# Altium schematic sheet fpga20-serdes-power.SchDoc
size Tabloid; SheetNumber: 49; SheetTotal: 71
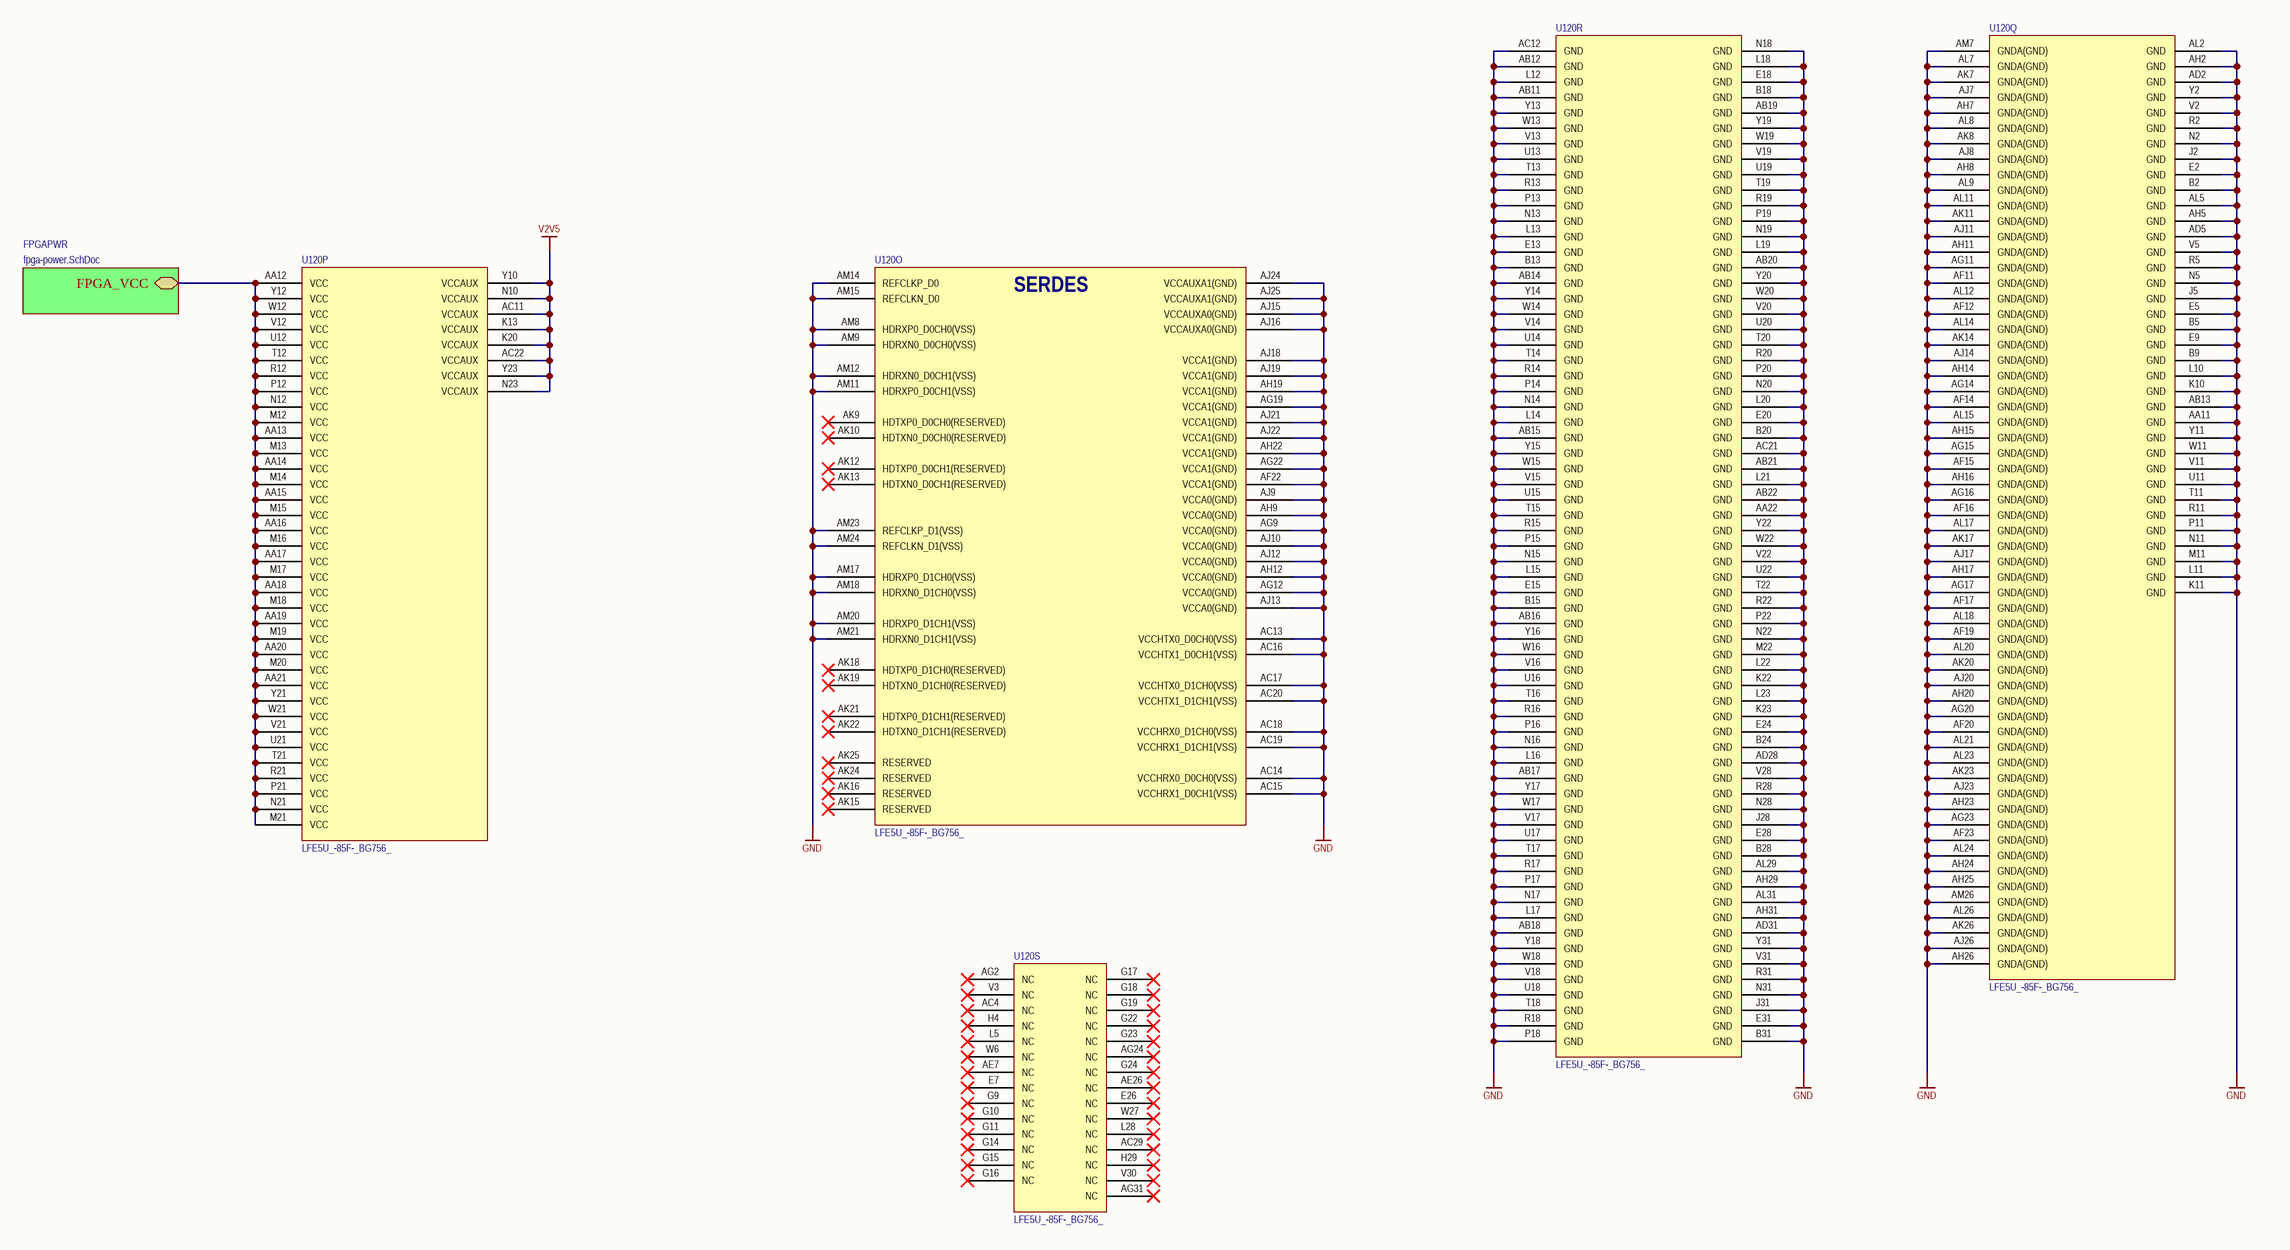
[diagram p0: fpga20-serdes-power.SchDoc]

## Parts
U120  LFE5U_-85F-_BG756_  [caBGA756]  (parts O,P,Q,R,S of 19)

## Sub-sheets
FPGAPWR = fpga-power.SchDoc: FPGA_VCC

## Nets
GND: U120.AA11(GND) U120.AA22(GND) U120.AB11(GND) U120.AB12(GND) U120.AB13(GND) U120.AB14(GND) U120.AB15(GND) U120.AB16(GND) U120.AB17(GND) U120.AB18(GND) U120.AB19(GND) U120.AB20(GND) U120.AB21(GND) U120.AB22(GND) U120.AC12(GND) U120.AC13(VCCHTX0_D0CH0(VSS)) U120.AC14(VCCHRX0_D0CH0(VSS)) U120.AC15(VCCHRX1_D0CH1(VSS)) U120.AC16(VCCHTX1_D0CH1(VSS)) U120.AC17(VCCHTX0_D1CH0(VSS)) U120.AC18(VCCHRX0_D1CH0(VSS)) U120.AC19(VCCHRX1_D1CH1(VSS)) U120.AC20(VCCHTX1_D1CH1(VSS)) U120.AC21(GND) U120.AD2(GND) U120.AD5(GND) U120.AD28(GND) U120.AD31(GND) U120.AF11(GNDA(GND)) U120.AF12(GNDA(GND)) U120.AF14(GNDA(GND)) U120.AF15(GNDA(GND)) U120.AF16(GNDA(GND)) U120.AF17(GNDA(GND)) U120.AF19(GNDA(GND)) U120.AF20(GNDA(GND)) U120.AF22(VCCA1(GND)) U120.AF23(GNDA(GND)) U120.AG9(VCCA0(GND)) U120.AG11(GNDA(GND)) U120.AG12(VCCA0(GND)) U120.AG14(GNDA(GND)) U120.AG15(GNDA(GND)) U120.AG16(GNDA(GND)) U120.AG17(GNDA(GND)) U120.AG19(VCCA1(GND)) U120.AG20(GNDA(GND)) U120.AG22(VCCA1(GND)) U120.AG23(GNDA(GND)) U120.AH2(GND) U120.AH5(GND) U120.AH7(GNDA(GND)) U120.AH8(GNDA(GND)) U120.AH9(VCCA0(GND)) U120.AH11(GNDA(GND)) U120.AH12(VCCA0(GND)) U120.AH14(GNDA(GND)) U120.AH15(GNDA(GND)) U120.AH16(GNDA(GND)) U120.AH17(GNDA(GND)) U120.AH19(VCCA1(GND)) U120.AH20(GNDA(GND)) U120.AH22(VCCA1(GND)) U120.AH23(GNDA(GND)) U120.AH24(GNDA(GND)) U120.AH25(GNDA(GND)) U120.AH26(GNDA(GND)) U120.AH29(GND) U120.AH31(GND) U120.AJ7(GNDA(GND)) U120.AJ8(GNDA(GND)) U120.AJ9(VCCA0(GND)) U120.AJ10(VCCA0(GND)) U120.AJ11(GNDA(GND)) U120.AJ12(VCCA0(GND)) U120.AJ13(VCCA0(GND)) U120.AJ14(GNDA(GND)) U120.AJ15(VCCAUXA0(GND)) U120.AJ16(VCCAUXA0(GND)) U120.AJ17(GNDA(GND)) U120.AJ18(VCCA1(GND)) U120.AJ19(VCCA1(GND)) U120.AJ20(GNDA(GND)) U120.AJ21(VCCA1(GND)) U120.AJ22(VCCA1(GND)) U120.AJ23(GNDA(GND)) U120.AJ24(VCCAUXA1(GND)) U120.AJ25(VCCAUXA1(GND)) U120.AJ26(GNDA(GND)) U120.AK7(GNDA(GND)) U120.AK8(GNDA(GND)) U120.AK11(GNDA(GND)) U120.AK14(GNDA(GND)) U120.AK17(GNDA(GND)) U120.AK20(GNDA(GND)) U120.AK23(GNDA(GND)) U120.AK26(GNDA(GND)) U120.AL2(GND) U120.AL5(GND) U120.AL7(GNDA(GND)) U120.AL8(GNDA(GND)) U120.AL9(GNDA(GND)) U120.AL11(GNDA(GND)) U120.AL12(GNDA(GND)) U120.AL14(GNDA(GND)) U120.AL15(GNDA(GND)) U120.AL17(GNDA(GND)) U120.AL18(GNDA(GND)) U120.AL20(GNDA(GND)) U120.AL21(GNDA(GND)) U120.AL23(GNDA(GND)) U120.AL24(GNDA(GND)) U120.AL26(GNDA(GND)) U120.AL29(GND) U120.AL31(GND) U120.AM7(GNDA(GND)) U120.AM8(HDRXP0_D0CH0(VSS)) U120.AM9(HDRXN0_D0CH0(VSS)) U120.AM11(HDRXP0_D0CH1(VSS)) U120.AM12(HDRXN0_D0CH1(VSS)) U120.AM14(REFCLKP_D0) U120.AM15(REFCLKN_D0) U120.AM17(HDRXP0_D1CH0(VSS)) U120.AM18(HDRXN0_D1CH0(VSS)) U120.AM20(HDRXP0_D1CH1(VSS)) U120.AM21(HDRXN0_D1CH1(VSS)) U120.AM23(REFCLKP_D1(VSS)) U120.AM24(REFCLKN_D1(VSS)) U120.AM26(GNDA(GND)) U120.B2(GND) U120.B5(GND) U120.B9(GND) U120.B13(GND) U120.B15(GND) U120.B18(GND) U120.B20(GND) U120.B24(GND) U120.B28(GND) U120.B31(GND) U120.E2(GND) U120.E5(GND) U120.E9(GND) U120.E13(GND) U120.E15(GND) U120.E18(GND) U120.E20(GND) U120.E24(GND) U120.E28(GND) U120.E31(GND) U120.J2(GND) U120.J5(GND) U120.J28(GND) U120.J31(GND) U120.K10(GND) U120.K11(GND) U120.K22(GND) U120.K23(GND) U120.L10(GND) U120.L11(GND) U120.L12(GND) U120.L13(GND) U120.L14(GND) U120.L15(GND) U120.L16(GND) U120.L17(GND) U120.L18(GND) U120.L19(GND) U120.L20(GND) U120.L21(GND) U120.L22(GND) U120.L23(GND) U120.M11(GND) U120.M22(GND) U120.N2(GND) U120.N5(GND) U120.N11(GND) U120.N13(GND) U120.N14(GND) U120.N15(GND) U120.N16(GND) U120.N17(GND) U120.N18(GND) U120.N19(GND) U120.N20(GND) U120.N22(GND) U120.N28(GND) U120.N31(GND) U120.P11(GND) U120.P13(GND) U120.P14(GND) U120.P15(GND) U120.P16(GND) U120.P17(GND) U120.P18(GND) U120.P19(GND) U120.P20(GND) U120.P22(GND) U120.R2(GND) U120.R5(GND) U120.R11(GND) U120.R13(GND) U120.R14(GND) U120.R15(GND) U120.R16(GND) U120.R17(GND) U120.R18(GND) U120.R19(GND) U120.R20(GND) U120.R22(GND) U120.R28(GND) U120.R31(GND) U120.T11(GND) U120.T13(GND) U120.T14(GND) U120.T15(GND) U120.T16(GND) U120.T17(GND) U120.T18(GND) U120.T19(GND) U120.T20(GND) U120.T22(GND) U120.U11(GND) U120.U13(GND) U120.U14(GND) U120.U15(GND) U120.U16(GND) U120.U17(GND) U120.U18(GND) U120.U19(GND) U120.U20(GND) U120.U22(GND) U120.V2(GND) U120.V5(GND) U120.V11(GND) U120.V13(GND) U120.V14(GND) U120.V15(GND) U120.V16(GND) U120.V17(GND) U120.V18(GND) U120.V19(GND) U120.V20(GND) U120.V22(GND) U120.V28(GND) U120.V31(GND) U120.W11(GND) U120.W13(GND) U120.W14(GND) U120.W15(GND) U120.W16(GND) U120.W17(GND) U120.W18(GND) U120.W19(GND) U120.W20(GND) U120.W22(GND) U120.Y2(GND) U120.Y11(GND) U120.Y13(GND) U120.Y14(GND) U120.Y15(GND) U120.Y16(GND) U120.Y17(GND) U120.Y18(GND) U120.Y19(GND) U120.Y20(GND) U120.Y22(GND) U120.Y31(GND)
V2V5: U120.AC11(VCCAUX) U120.AC22(VCCAUX) U120.K13(VCCAUX) U120.K20(VCCAUX) U120.N10(VCCAUX) U120.N23(VCCAUX) U120.Y10(VCCAUX) U120.Y23(VCCAUX)
NetU120_AA12: U120.AA12(VCC) U120.AA13(VCC) U120.AA14(VCC) U120.AA15(VCC) U120.AA16(VCC) U120.AA17(VCC) U120.AA18(VCC) U120.AA19(VCC) U120.AA20(VCC) U120.AA21(VCC) U120.M12(VCC) U120.M13(VCC) U120.M14(VCC) U120.M15(VCC) U120.M16(VCC) U120.M17(VCC) U120.M18(VCC) U120.M19(VCC) U120.M20(VCC) U120.M21(VCC) U120.N12(VCC) U120.N21(VCC) U120.P12(VCC) U120.P21(VCC) U120.R12(VCC) U120.R21(VCC) U120.T12(VCC) U120.T21(VCC) U120.U12(VCC) U120.U21(VCC) U120.V12(VCC) U120.V21(VCC) U120.W12(VCC) U120.W21(VCC) U120.Y12(VCC) U120.Y21(VCC) ; sheet FPGAPWR/FPGA_VCC

Not connected (* = marked no-connect by the designer): U120 AC4(NC)* AC29(NC)* AE7(NC)* AE26(NC)* AG2(NC)* AG24(NC)* AG31(NC)* AK9(HDTXP0_D0CH0(RESERVED))* AK10(HDTXN0_D0CH0(RESERVED))* AK12(HDTXP0_D0CH1(RESERVED))* AK13(HDTXN0_D0CH1(RESERVED))* AK15(RESERVED)* AK16(RESERVED)* AK18(HDTXP0_D1CH0(RESERVED))* AK19(HDTXN0_D1CH0(RESERVED))* AK21(HDTXP0_D1CH1(RESERVED))* AK22(HDTXN0_D1CH1(RESERVED))* AK24(RESERVED)* AK25(RESERVED)* E7(NC)* E26(NC)* G9(NC)* G10(NC)* G11(NC)* G14(NC)* G15(NC)* G16(NC)* G17(NC)* G18(NC)* G19(NC)* G22(NC)* G23(NC)* G24(NC)* H4(NC)* H29(NC)* L5(NC)* L28(NC)* V3(NC)* V30(NC)* W6(NC)* W27(NC)*

## Notes on the sheet
- (in symbol LFE5U_-85F-_BG756_, part O) SERDES

## Library data of the parts
U120 = LFE5U_-85F-_BG756_: ECP5 FPGA, 85k LUT, 756-caBGA; Manufacturer: Lattice Semiconductor; Manufacturer P/N: LFE5U_-85F-_BG756_